# Altium schematic sheet 00-82230KPC-1-K_README.SchDoc: 84736EMB-A-V1.0-230407
size 420 x 297 mm; CheckedBy: 朱胜强; Engineer: 朱胜强; DocumentNumber: 00-Readme; Revision: V1.0; SheetNumber: 1; SheetTotal: 2; 日期: 2023.04.07
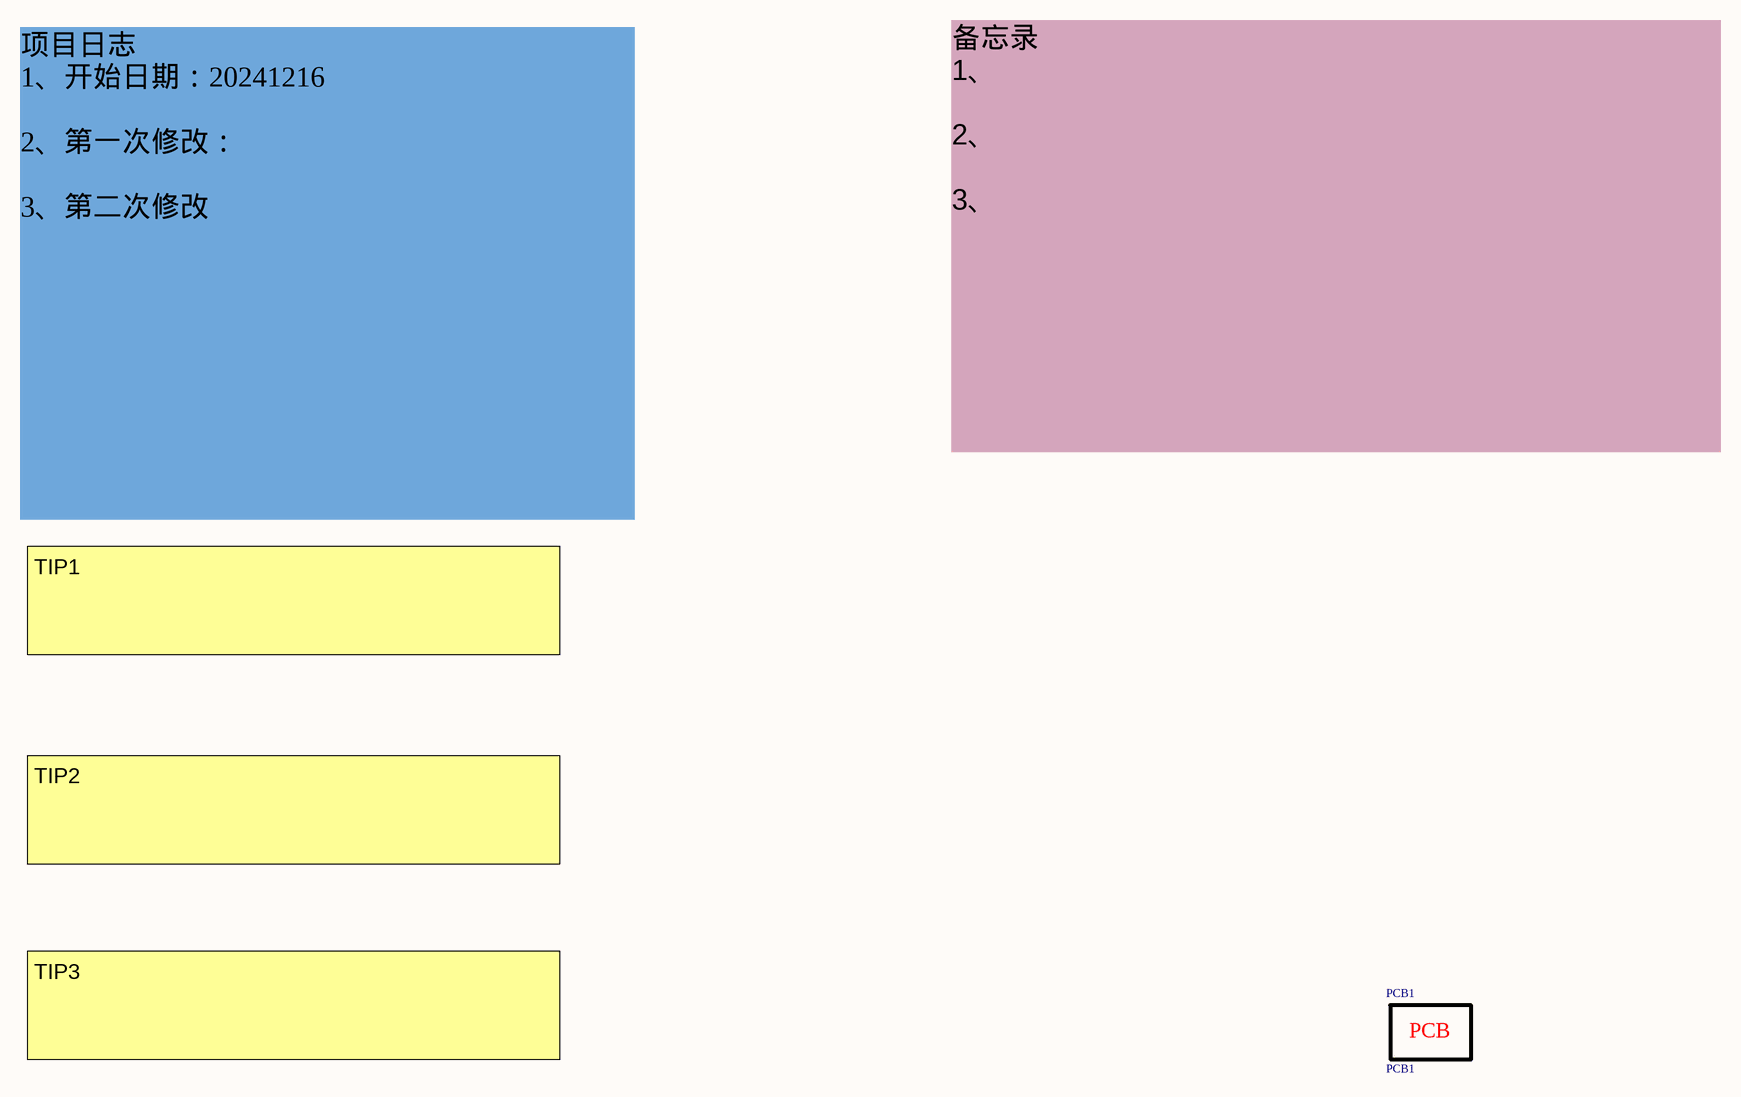
[diagram p0: 00-82230KPC-1-K_README.SchDoc]

## Parts
PCB1  PCB1  [PCB]

## Notes on the sheet
- 备忘录
  1、
  2、
  3、
- 项目日志
  1、开始日期：20241216
  2、第一次修改：
  3、第二次修改
- TIP1
- TIP2
- TIP3
- 改
- 修
- 位号
- 旧值
- 新值
- 原因
- 日期
- Title
- 设计：
- 说
- 明
- Size:
- File:
- 日期：
- A3
- Revision:
- 图页：
- Sheet
- of
- 审核：
- 批准：
- (in symbol PCB1) PCB

## Library data of the parts
PCB1 = PCB1: PCB  82230KC-1-K 按键板 版本号：82230KC-1-K-1V0-241216*3版 尺寸：190.2*162.8双面板  铜厚1/1oz 板厚 1.6M 过孔盖油 无铅喷锡 绿油白丝印字 全部测试